# Altium schematic sheet Pg1 Top Sheet and Micro.SchDoc: BMS - Micro controller
size Letter; Organization: Kettering University; Address1: EV Kartz; Address2: Battery; Address3: Flint, MI; Address4: United States of America; DocumentNumber: 1; Revision: 1; SheetNumber: 1; SheetTotal: 4
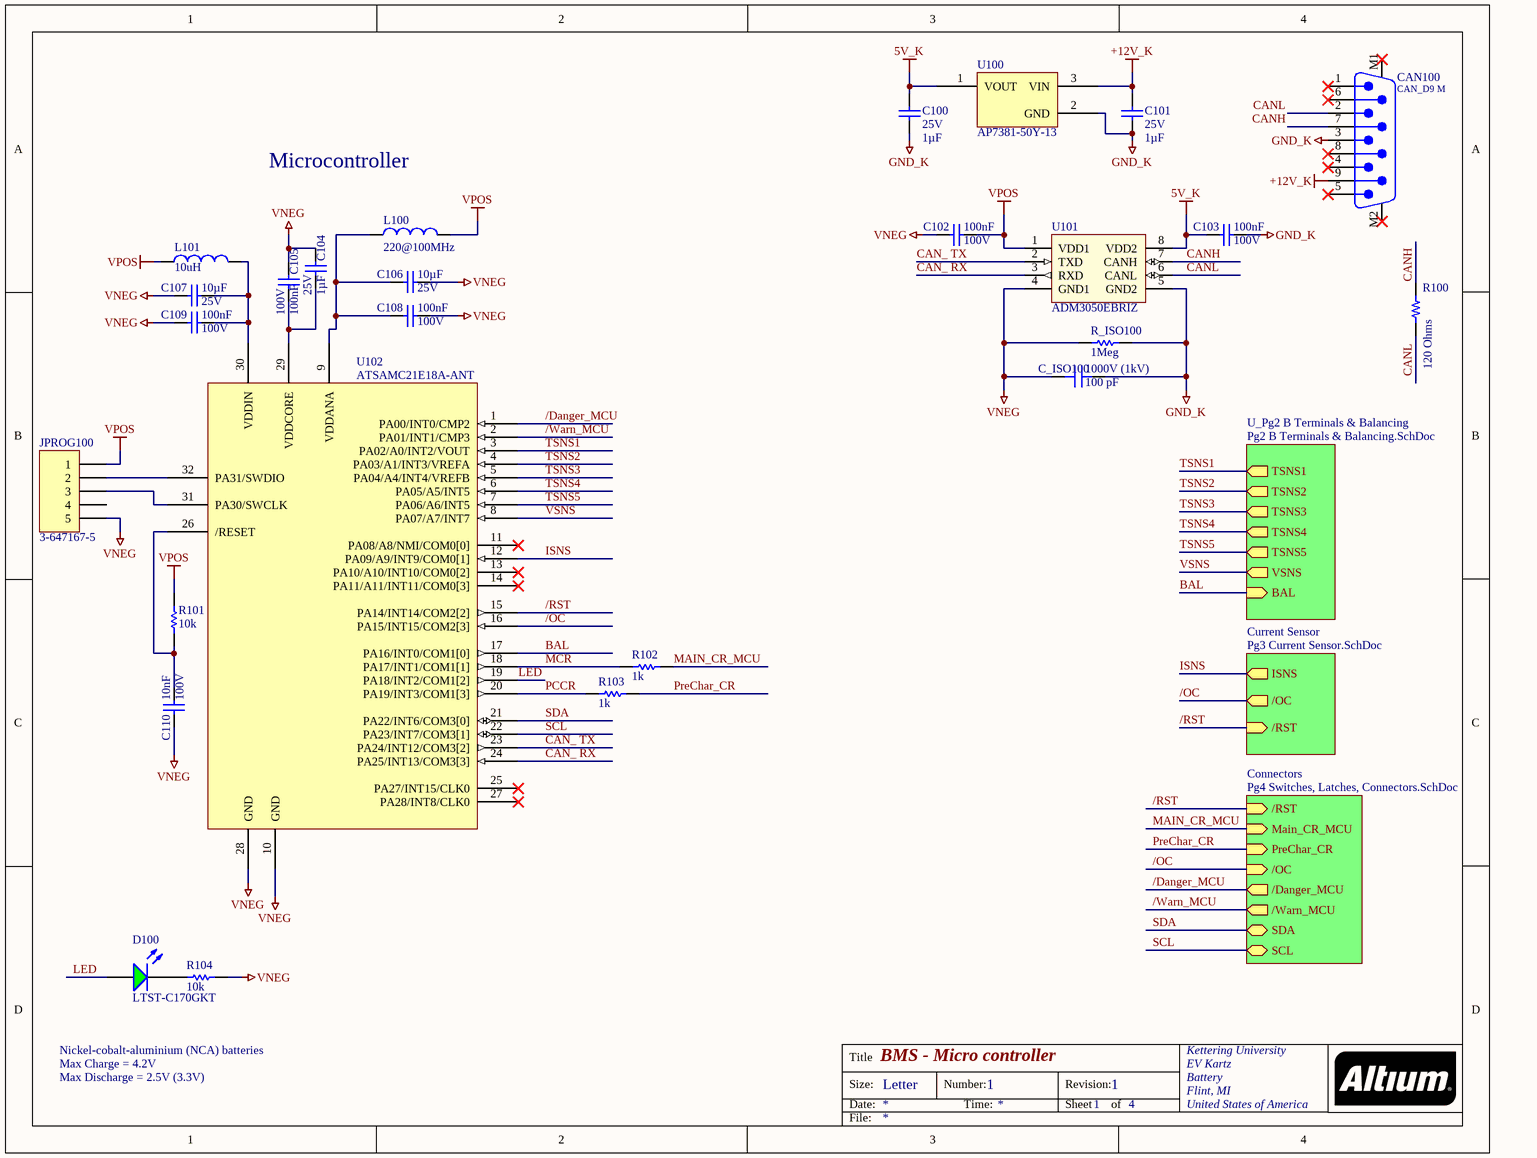
[diagram p0: Pg1 Top Sheet and Micro.SchDoc]

## Parts
C100  value 1µF  Rated: 25V  [CAPC2012N]  (hidden comment: C0805C105K3RAC7210)
C101  value 1µF  Rated: 25V  [CAPC2012N]  (hidden comment: C0805C105K3RAC7210)
C102  value 100nF  Rated: 100V  [CAPC2012N]  (hidden comment: C0805C104K1RACAUTO)
C103  value 100nF  Rated: 100V  [CAPC2012N]  (hidden comment: C0805C104K1RACAUTO)
C104  value 1µF  Rated: 25V  [CAPC2012N]  (hidden comment: C0805C105K3RAC7210)
C105  value 100nF  Rated: 100V  [CAPC2012N]  (hidden comment: C0805C104K1RACAUTO)
C106  value 10µF  Rated: 25V  [CAPC3225N]  (hidden comment: C1210C106K3RACAUTO)
C107  value 10µF  Rated: 25V  [CAPC3225N]  (hidden comment: C1210C106K3RACAUTO)
C108  value 100nF  Rated: 100V  [CAPC2012N]  (hidden comment: C0805C104K1RACAUTO)
C109  value 100nF  Rated: 100V  [CAPC2012N]  (hidden comment: C0805C104K1RACAUTO)
C110  value 10nF  Rated: 100V  [CAPC2012N]  (hidden comment: C0805C103K1RAC7025)
C_ISO100  Voltage - Rated: 1000V (1kV)  [CAP 1206_3216 - 0.8MM]  (hidden comment: 100 pF)
CAN100  CAN_D9 M  [618009211721]
D100  LTST-C170GKT  [DIO2012N-G]
JPROG100  3-647167-5  [HDR1X5 SMT]
L100  value 220@100MHz  [INDC2012N]  (hidden comment: 742792022)
L101  value 10uH  [INDC3225N]  (hidden comment: BRL3225T100K)
R100  120 Ohms  [RES 0805_2012]
R101  value 10k  [RESC2012N]  (hidden comment: ERJ-6ENF1002V)
R102  value 1k  [RESC2012N]  (hidden comment: ERJ-6ENF1001V)
R103  value 1k  [RESC2012N]  (hidden comment: ERJ-6ENF1001V)
R104  value 10k  [RESC2012N]  (hidden comment: ERJ-6ENF1002V)
R_ISO100  value 1Meg  [RESC2012N]  (hidden comment: ERJ-6ENF1004V)
U100  AP7381-50Y-13  [DIODES INC SOT-89]
U101  ADM3050EBRIZ  [SOIC-8-300]
U102  ATSAMC21E18A-ANT  [SAMC21]

## Sub-sheets
Connectors = Pg4 Switches, Latches, Connectors.SchDoc: /RST (in), Main_CR_MCU (in), PreChar_CR (in), /Warn_MCU (out), /Danger_MCU (out), /OC (in), SDA (bidir), SCL (bidir)
Current Sensor = Pg3 Current Sensor.SchDoc: ISNS (out), /RST (in), /OC (out)
U_Pg2 B Terminals & Balancing = Pg2 B Terminals & Balancing.SchDoc: VSNS (out), TSNS1 (out), TSNS2 (out), TSNS3 (out), TSNS4 (out), TSNS5 (out), BAL (in)

## Nets
5V_K: C100.1 C103.1 U100.1(VOUT) U101.8(VDD2)
+12V_K: C101.1 CAN100.9 U100.3(VIN)
GND_K: C100.2 C101.2 C103.2 C_ISO100.2 CAN100.3 R_ISO100.2 U100.2(GND) U101.5(GND2)
VNEG: C102.1 C104.1 C105.1 C106.2 C107.1 C108.2 C109.1 C110.2 C_ISO100.1 JPROG100.5 R104.1 R_ISO100.1 U101.4(GND1) U102.10(GND) U102.28(GND)
VPOS: C102.2 JPROG100.1 L100.2 L101.1 R101.1 U101.1(VDD1)
/Danger_MCU: U102.1(PA00/INT0/CMP2) ; sheet Connectors//Danger_MCU
/OC: U102.16(PA15/INT15/COM2[3]) ; sheet Current Sensor//OC, sheet Connectors//OC
/RST: U102.15(PA14/INT14/COM2[2]) ; sheet Current Sensor//RST, sheet Connectors//RST
/Warn_MCU: U102.2(PA01/INT1/CMP3) ; sheet Connectors//Warn_MCU
BAL: U102.17(PA16/INT0/COM1[0]) ; sheet U_Pg2 B Terminals & Balancing/BAL
CAN_ RX: U101.3(RXD) U102.24(PA25/INT13/COM3[3])
CAN_ TX: U101.2(TXD) U102.23(PA24/INT12/COM3[2])
CANH: CAN100.7 R100.2 U101.7(CANH)
CANL: CAN100.2 R100.1 U101.6(CANL)
ISNS: U102.12(PA09/A9/INT9/COM0[1]) ; sheet Current Sensor/ISNS
LED: D100.1(A) U102.19(PA18/INT2/COM1[2])
MAIN_CR_MCU: R102.2 ; sheet Connectors/Main_CR_MCU
MCR: R102.1 U102.18(PA17/INT1/COM1[1])
PCCR: R103.1 U102.20(PA19/INT3/COM1[3])
PreChar_CR: R103.2 ; sheet Connectors/PreChar_CR
SCL: U102.22(PA23/INT7/COM3[1]) ; sheet Connectors/SCL
SDA: U102.21(PA22/INT6/COM3[0]) ; sheet Connectors/SDA
TSNS1: U102.3(PA02/A0/INT2/VOUT) ; sheet U_Pg2 B Terminals & Balancing/TSNS1
TSNS2: U102.4(PA03/A1/INT3/VREFA) ; sheet U_Pg2 B Terminals & Balancing/TSNS2
TSNS3: U102.5(PA04/A4/INT4/VREFB) ; sheet U_Pg2 B Terminals & Balancing/TSNS3
TSNS4: U102.6(PA05/A5/INT5) ; sheet U_Pg2 B Terminals & Balancing/TSNS4
TSNS5: U102.7(PA06/A6/INT5) ; sheet U_Pg2 B Terminals & Balancing/TSNS5
VSNS: U102.8(PA07/A7/INT7) ; sheet U_Pg2 B Terminals & Balancing/VSNS
NetC104_2: C104.2 C105.2 U102.29(VDDCORE)
NetC106_1: C106.1 C108.1 L100.1 U102.9(VDDANA)
NetC107_2: C107.2 C109.2 L101.2 U102.30(VDDIN)
NetC110_1: C110.1 R101.2 U102.26(/RESET)
NetD100_2: D100.2(K) R104.2
NetJPROG100_2: JPROG100.2 U102.32(PA31/SWDIO)
NetJPROG100_3: JPROG100.3 U102.31(PA30/SWCLK)

Not connected (* = marked no-connect by the designer): CAN100 1* 4* 5* 6* 8* M1* M2*; JPROG100 4; U102 11(PA08/A8/NMI/COM0[0])* 13(PA10/A10/INT10/COM0[2])* 14(PA11/A11/INT11/COM0[3])* 25(PA27/INT15/CLK0)* 27(PA28/INT8/CLK0)*

## Notes on the sheet
- Microcontroller
- Nickel-cobalt-aluminium (NCA) batteries
- Max Charge = 4.2V
- Max Discharge = 2.5V (3.3V)
- Title
- Size:
- Date:
- Letter
- Number:
- Time:
- Revision:
- Sheet
- of
- File:

## Library data of the parts
C100 C101 C104 = C0805C105K3RAC7210: Capacitor, Ceramic, 1µF, 25V, 0805, 10%, 125C; Supplier 1: Digi-Key; Supplier Part Number 1: 399-C0805C105K3RAC7210CT-ND; Category: C; Tol: 10%; Temp: 125C
C102 C103 C105 C108 C109 = C0805C104K1RACAUTO: Capacitor, Ceramic, 100nF, 100V, 0805, 10%, 125C; Supplier 1: Digi-Key; Supplier Part Number 1: 399-6926-1-ND; Category: C; Tol: 10%; Temp: 125C
C106 C107 = C1210C106K3RACAUTO: Capacitor, Ceramic, 10µF, 25V, 0805, 10%, 125C; Supplier 1: Digi-Key; Supplier Part Number 1: 399-7046-1-ND; Category: C; Tol: 10%; Temp: 125C
C110 = C0805C103K1RAC7025: Capacitor, Ceramic, 10nF, 100V, 0805, 10%, 125C; Supplier 1: Digi-Key; Supplier Part Number 1: 399-C0805C103K1RAC7025CT-ND; Category: C; Tol: 10%; Temp: 125C
C_ISO100 = CL31C101JIFNFNE: CAP CER 100PF 1KV C0G/NP0 1206; manufacturer: Samsung Electro-Mechanics; Temperature Coefficient: C0G, NP0; Tolerance: ±5%; Part Number: CL31C101JIFNFNE; Value: 100 pF; Applications: General Purpose; Capacitance: 100 pF; componentlink1description: Datasheet; componentlink1url: http://www.samsungsem.com/kr/support/product-search/mlcc/CL31C101JIFNFNE.jsp; componentlink2description: DigiKey Link; componentlink2url: https://www.digikey.com/en/products/detail/samsung-electro-mechanics/CL31C101JIFNFNE/3888857; Device Package: 1206 (3216 Metric); lastupdated: 2/4/2023 8:13:04 PM; Lifecycle Status: Active; Minimum Order: 1; Mounting Type: Surface Mount, MLCC; Operating Temperature: -55°C ~ 125°C; Package / Case: 1206 (3216 Metric); packaging: TapeAndReel; partid: 22341; Part Status: Active; price: 0.05; series: CL; Size / Dimension: 0.126" L x 0.063" W (3.20mm x 1.60mm); Supplier 1: DigiKey; Supplier Part Number 1: 1276-3199-1-ND; Thickness (Max): 0.055" (1.40mm)
CAN100 = CMP-1502-00292-1: Male PCB Connector without Hex Screw WR-DSUB, 8.08 mm, Angled, 9 pins; Manufacturer: Wurth Elektronik; Rated Current: 3A; Working Voltage: 125VAC; Pin Number: 9; Contact Resistance: 30mOhm; Publisher: WurthElektronik; Operating Temperature: -40to85degC; Part Number: 618009211721; Package Reference: 618009211721; Manufacturer URL: http://www.we-online.de; Mounting Technology: THT; Datasheet URL: https://katalog.we-online.de/em/datasheet/6180xx211721.pdf; Gender: Male; Packaging: Tray; Orientation: Angled
D100 = LTST-C170GKT: LED, SMT 0805, Green, 2.1V, 10mA; Rated: 2.1V, 10mA, 6mcd; Value: GRN; Supplier 1: Digi-Key; Supplier Part Number 1: 160-1179-1-ND; Category: D
JPROG100 = Hdr 3-647167-5: Header, 1x5-Pin, SMT, 100mil Pitch; Category: J; Supplier 1: Digi-Key; Supplier Part Number 1: A144616-ND
L100 = 742792022: Inductor, 220 Ohms @ 100MHz, 2A, 50 mOhm, Ferrite Bead; Category: L; Supplier 1: Digi-Key; Supplier Part Number 1: 732-1614-1-ND; Rated: 2A
L101 = BRL3225T100K: Inductor, 10uH, 700mA, 420mOhm, Ferrite Bead; Rated: 700mA, 0.42 Ohm; Category: L; Supplier 1: Digi-Key; Supplier Part Number 1: 587-2167-1-ND
R100 = RC0805FR-07120RL: RES 120 OHM 1% 1/8W 0805; Manufacturer: Yageo; Power (Watts): 0.125W, 1/8W; Temperature Coefficient: ±100ppm/°C; Part Number: RC0805FR-07120RL; Value: 120 Ohms; ComponentLink1Description: Datasheet; ComponentLink1URL: https://www.yageo.com/upload/media/product/productsearch/datasheet/rchip/PYu-RC_Group_51_RoHS_L_10.pdf; ComponentLink2Description: DigiKey Link; ComponentLink2URL: https://www.digikey.com/en/products/detail/yageo/RC0805FR-07120RL/727575; Composition: Thick Film; Device Package: 0805 (2012 Metric); Features: Moisture Resistant; Height - Seated (Max): 0.024" (0.60mm); LastUpdated: 2/3/2023 8:42:17 PM; Lifecycle Status: Active; Minimum Order: 1; Number of Terminations: 2; Operating Temperature: -55°C ~ 155°C; Package / Case: 0805 (2012 Metric); Packaging: CutTape; PartId: 39440; Part Status: Active; Price: 0.01; Resistance: 120 Ohms; Series: RC_L; Size / Dimension: 0.079" L x 0.049" W (2.00mm x 1.25mm); Supplier 1: DigiKey; Supplier Part Number 1: 311-120CRCT-ND; Supplier Device Package: 0805; Tolerance: ±1%
R101 R104 = ERJ-6ENF1002V: Resistor, Fixed, 10 kOhm, 0805, 1%, 1/8W; Supplier 1: Digi-Key; Supplier Part Number 1: P10.0KCCT-ND; Rated: 1/8W; Tol: 1%; Category: R
R102 R103 = ERJ-6ENF1001V: Resistor, Fixed, 1 kOhm, 0805, 1%, 1/8W; Supplier 1: Digi-Key; Supplier Part Number 1: P1.00KCCT-ND; Rated: 1/8W; Tol: 1%; Category: R
R_ISO100 = ERJ-6ENF1004V: Resistor, Fixed, 1 MOhm, 0805, 1%, 1/8W; Supplier 1: Digi-Key; Supplier Part Number 1: P1.00MCCT-ND; Rated: 1/8W; Tol: 1%; Category: R
U100 = AP7381-50Y-13: IC REG LINEAR 5V 150MA SOT89; Manufacturer: Diodes Incorporated; Current - Quiescent (Iq): 2.5 µA; Current - Supply (Max): 25 µA; Number of Regulators: 1; Output Configuration: Positive; Output Type: Fixed; Protection Features: Current Limit, Thermal Shutdown; Voltage Dropout (Max): 1V @ 100mA; Voltage - Input (Max): 40V; Part Number: AP7381-50Y-13; ComponentLink1Description: Datasheet; ComponentLink1URL: https://www.diodes.com/assets/Datasheets/AP7381.pdf; ComponentLink2Description: DigiKey Link; ComponentLink2URL: https://www.digikey.com/en/products/detail/diodes-incorporated/AP7381-50Y-13/7914855; Current - Output: 150mA; LastUpdated: 2/3/2023 9:04:39 PM; Lifecycle Status: Active; Minimum Order: 1; Mounting Type: Surface Mount; Operating Temperature: -40°C ~ 125°C (TJ); Package / Case: TO-243AA; Packaging: TapeAndReel; Part Status: Active; Price: 0.09; Series: -; Supplier 1: DigiKey; Supplier Part Number 1: AP7381-50Y-13DICT-ND; Supplier Device Package: SOT-89-3; Voltage - Output (Min/Fixed): 5V
U101 = ADM3050EBRIZ: IC, Transceiver, CAN FD, 0.5-6V, ISOLATED; Category: U; Supplier 1: Digi-Key; Supplier Part Number 1: 505-ADM3050EBRIZ-ND
U102 = ATSAMC21E: ARM Microcontrollers - MCU 32TQFP,105C TEMP, GREEN, 5V, 48MHZ; Supplier 1: Mouser; Supplier Part Number 1: 556-ATSAMC21E18A-ANT